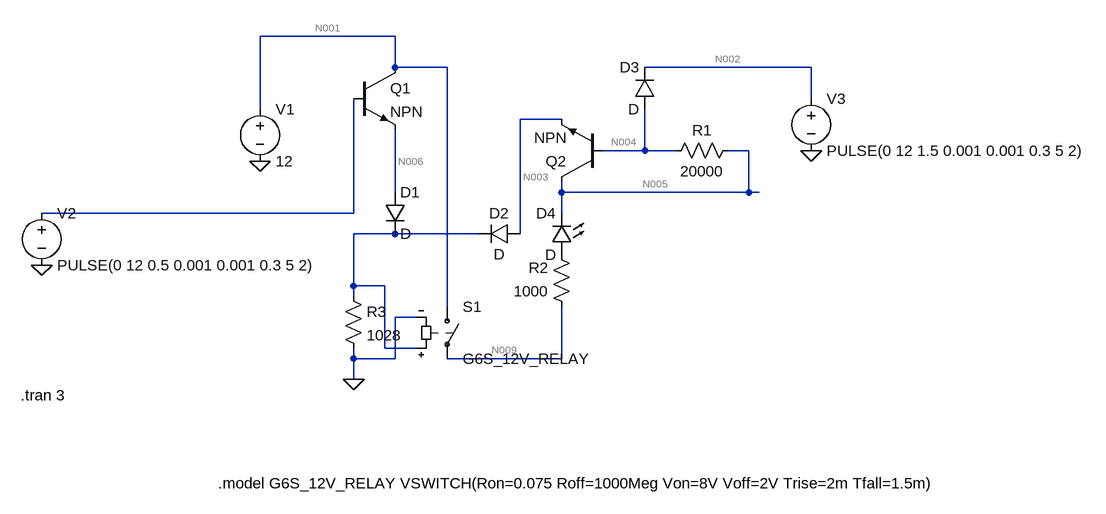
[diagram p0: schematic lock.asc]
lock.asc, the LTspice schematic file:
Version 4.1
SHEET 1 1328 752
WIRE 240 48 32 48
WIRE 240 96 240 48
WIRE 320 96 240 96
WIRE 880 96 624 96
WIRE 880 144 880 96
WIRE 32 160 32 48
WIRE 496 176 432 176
WIRE 624 224 624 160
WIRE 624 224 560 224
WIRE 672 224 624 224
WIRE 784 224 752 224
WIRE 240 288 240 192
WIRE 496 288 496 272
WIRE 784 288 784 224
WIRE 784 288 496 288
WIRE 800 288 784 288
WIRE 176 320 176 144
WIRE 176 320 -304 320
WIRE 496 320 496 288
WIRE 240 352 176 352
WIRE 368 352 240 352
WIRE 432 352 432 176
WIRE 176 432 176 352
WIRE 224 432 176 432
WIRE 176 448 176 432
WIRE 320 464 320 96
WIRE 272 480 240 480
WIRE 224 528 224 432
WIRE 272 528 224 528
WIRE 176 544 176 528
WIRE 240 544 240 480
WIRE 240 544 176 544
WIRE 496 544 496 464
WIRE 496 544 320 544
WIRE 176 576 176 544
FLAG 176 576 0
FLAG -304 400 0
FLAG 880 224 0
FLAG 32 240 0
SYMBOL npn 176 96 R0
SYMATTR InstName Q1
SYMBOL diode 224 288 R0
SYMATTR InstName D1
SYMBOL diode 432 336 R90
WINDOW 0 0 32 VBottom 2
WINDOW 3 32 32 VTop 2
SYMATTR InstName D2
SYMBOL npn 560 272 R180
SYMATTR InstName Q2
SYMBOL res 768 208 R90
WINDOW 0 0 56 VBottom 2
WINDOW 3 32 56 VTop 2
SYMATTR InstName R1
SYMATTR Value 20000
SYMBOL diode 640 160 R180
WINDOW 0 24 64 Left 2
WINDOW 3 24 0 Left 2
SYMATTR InstName D3
SYMBOL LED 512 384 R180
WINDOW 0 24 64 Left 2
WINDOW 3 24 0 Left 2
SYMATTR InstName D4
SYMBOL res 512 480 R180
WINDOW 0 36 76 Left 2
WINDOW 3 36 40 Left 2
SYMATTR InstName R2
SYMATTR Value 1000
SYMBOL sw 320 448 R0
SYMATTR InstName S1
SYMATTR Value G6S_12V_RELAY
SYMBOL res 160 432 R0
SYMATTR InstName R3
SYMATTR Value 1028
SYMBOL voltage 32 144 R0
WINDOW 123 0 0 Left 0
WINDOW 39 0 0 Left 0
SYMATTR InstName V1
SYMATTR Value 12
SYMBOL voltage -304 304 R0
WINDOW 123 0 0 Left 0
WINDOW 39 0 0 Left 0
SYMATTR InstName V2
SYMATTR Value PULSE(0 12 0.5 0.001 0.001 0.3 5 2)
SYMBOL voltage 880 128 R0
WINDOW 123 0 0 Left 0
WINDOW 39 0 0 Left 0
SYMATTR InstName V3
SYMATTR Value PULSE(0 12 1.5 0.001 0.001 0.3 5 2)
TEXT -336 600 Left 2 !.tran 3
TEXT -32 736 Left 2 !.model G6S_12V_RELAY VSWITCH(Ron=0.075 Roff=1000Meg Von=8V Voff=2V Trise=2m Tfall=1.5m)

The netlist it stands for:
* lock.asc
Q1 N001 N007 N006 0 NPN
D1 N006 N008 D
D2 N003 N008 D
Q2 N005 N004 N003 0 NPN
R1 N005 N004 20000
D3 N004 N002 D
D4 P001 N005 D
R2 N009 P001 1000
S1 N001 N009 N008 0 G6S_12V_RELAY
R3 N008 0 1028
V1 N001 0 12
V2 N007 0 PULSE(0 12 0.5 0.001 0.001 0.3 5 2)
V3 N002 0 PULSE(0 12 1.5 0.001 0.001 0.3 5 2)
.model D D
.lib standard.dio
.model NPN NPN
.model PNP PNP
.lib standard.bjt
.tran 3
.model G6S_12V_RELAY VSWITCH(Ron=0.075 Roff=1000Meg Von=8V Voff=2V Trise=2m Tfall=1.5m)
.backanno
.end

* Results of the author's LTspice run, read from the files saved beside the schematic
* Operating Point, zero values left out:
*   V(n001) = 12 V
*   V(n003) = 122.3 mV
*   V(n004) = 360.5 mV
*   V(n005) = 360.7 mV
*   V(n006) = 41.83 µV
*   V(n009) = 721.2 mV
*   V(p001) = 721.2 mV
*   I(D2) = 1.245 pA
*   I(D3) = 11.29 nA
*   I(D4) = 11.29 nA
*   I(R1) = 11.29 nA
*   I(R2) = 11.29 nA
*   I(R3) = 1.245 pA
*   I(S1) = -11.29 nA
*   I(V1) = -11.3 nA
*   I(V2) = 12 pA
*   I(V3) = 11.29 nA
*   Ib(Q1) = -12 pA
*   Ic(Q1) = 12 pA
*   Ie(Q2) = -1.245 pA
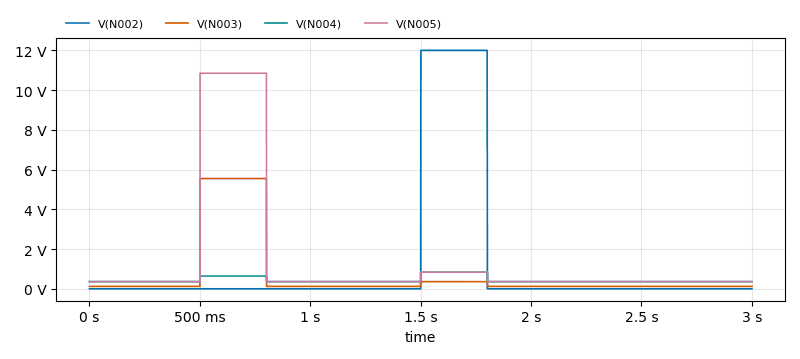
[diagram p1: Transient Analysis of lock.asc, plotted from the saved traces]
* Transient Analysis, 1 run:
*   V(N002): min 0 V, max 12 V, average 1.204 V, rms 3.799 V, last 0 V
*   V(N003): min 122.3 mV, max 5.549 V, average 690.5 mV, rms 1.764 V, last 122.3 mV
*   V(N004): min 360.5 mV, max 838.1 mV, average 436.3 mV, rms 464 mV, last 360.5 mV
*   V(N005): min 360.7 mV, max 10.85 V, average 1.461 V, rms 3.462 V, last 360.7 mV